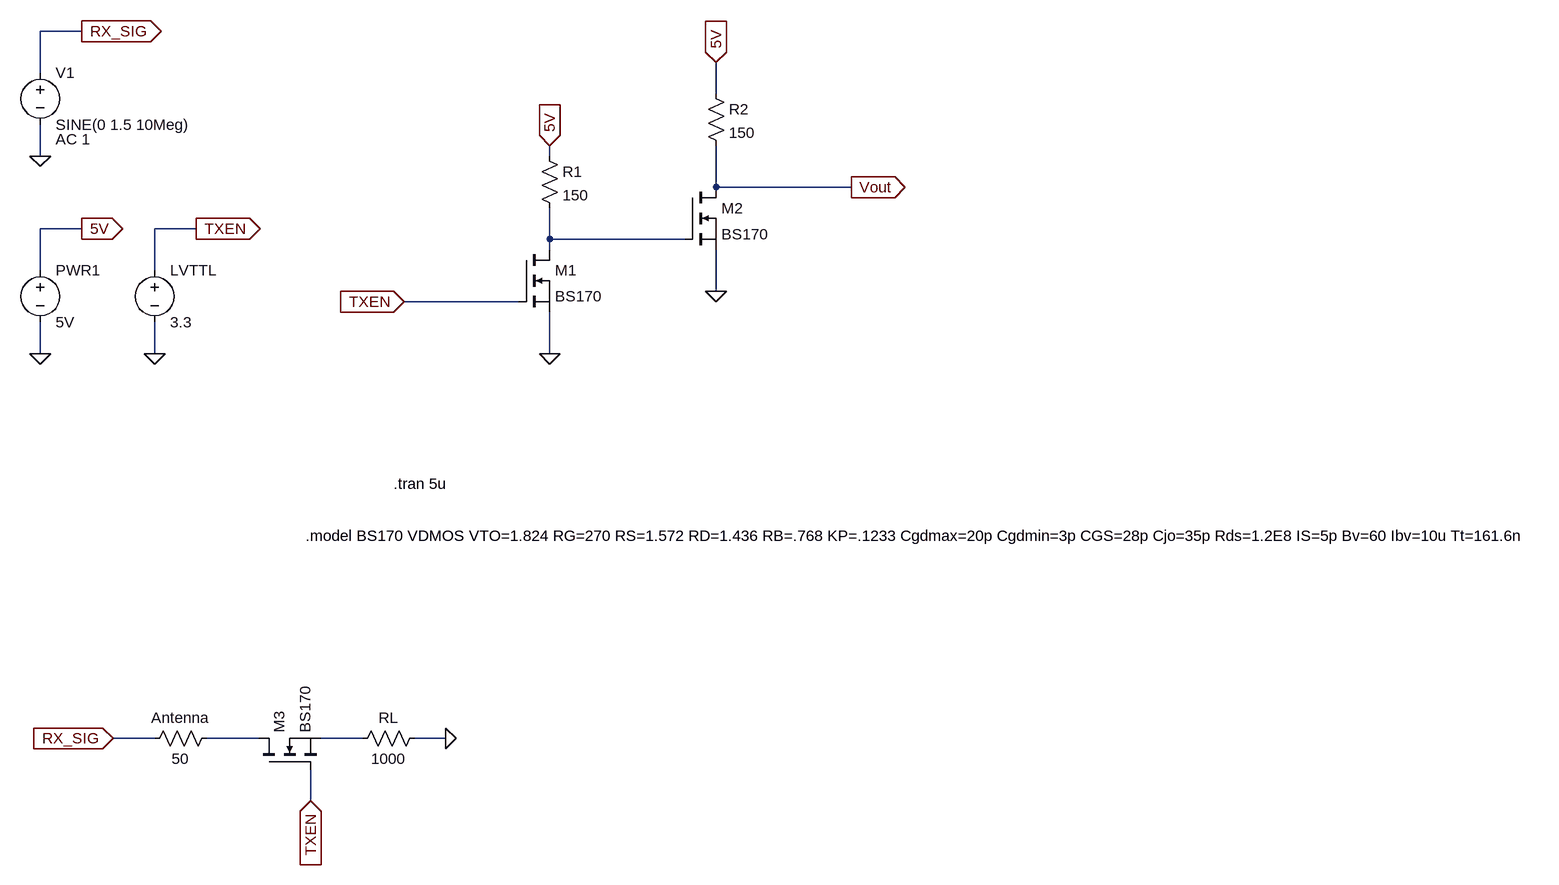
[diagram p0: schematic SwitchTXEN.asc]
SwitchTXEN.asc, the LTspice schematic file:
Version 4
SHEET 1 1924 1316
WIRE -304 -64 -368 -64
WIRE -368 0 -368 -64
WIRE 672 32 672 -16
WIRE -368 128 -368 80
WIRE 416 128 416 112
WIRE 672 176 672 112
WIRE 880 176 672 176
WIRE -304 240 -368 240
WIRE -128 240 -192 240
WIRE 416 256 416 208
WIRE 624 256 416 256
WIRE 416 272 416 256
WIRE -368 304 -368 240
WIRE -192 304 -192 240
WIRE 672 336 672 272
WIRE 368 352 192 352
WIRE -368 432 -368 384
WIRE -192 432 -192 384
WIRE 416 432 416 368
WIRE -192 1024 -256 1024
WIRE -32 1024 -112 1024
WIRE 128 1024 64 1024
WIRE 256 1024 208 1024
WIRE 48 1120 48 1072
FLAG -368 432 0
FLAG -304 240 5V
IOPIN -304 240 Out
FLAG -192 432 0
FLAG -128 240 TXEN
IOPIN -128 240 Out
FLAG 192 352 TXEN
IOPIN 192 352 In
FLAG 416 112 5V
IOPIN 416 112 In
FLAG 880 176 Vout
IOPIN 880 176 Out
FLAG 416 432 0
FLAG 672 336 0
FLAG -368 128 0
FLAG -304 -64 RX_SIG
IOPIN -304 -64 Out
FLAG 672 -16 5V
IOPIN 672 -16 In
FLAG -256 1024 RX_SIG
IOPIN -256 1024 In
FLAG 48 1120 TXEN
IOPIN 48 1120 In
FLAG 256 1024 0
SYMBOL Voltage -368 288 R0
SYMATTR InstName PWR1
SYMATTR Value 5V
SYMBOL Voltage -192 288 R0
SYMATTR InstName LVTTL
SYMATTR Value 3.3
SYMBOL Res 400 112 R0
SYMATTR InstName R1
SYMATTR Value 150
SYMBOL nmos 368 272 R0
SYMATTR InstName M1
SYMATTR Value BS170
SYMBOL nmos 624 176 R0
SYMATTR InstName M2
SYMATTR Value BS170
SYMBOL Res 656 16 R0
SYMATTR InstName R2
SYMATTR Value 150
SYMBOL Voltage -368 -16 R0
WINDOW 123 24 118 Left 2
SYMATTR Value2 AC 1
SYMATTR InstName V1
SYMATTR Value SINE(0 1.5 10Meg)
SYMBOL Res -96 1008 R90
WINDOW 0 0 56 VBottom 2
WINDOW 3 32 56 VTop 2
SYMATTR InstName Antenna
SYMATTR Value 50
SYMBOL nmos -32 1072 R270
SYMATTR InstName M3
SYMATTR Value BS170
SYMBOL Res 224 1008 R90
WINDOW 0 0 56 VBottom 2
WINDOW 3 32 56 VTop 2
SYMATTR InstName RL
SYMATTR Value 1000
TEXT 40 712 Left 2 !.model BS170 VDMOS VTO=1.824 RG=270 RS=1.572 RD=1.436 RB=.768 KP=.1233 Cgdmax=20p Cgdmin=3p CGS=28p Cjo=35p Rds=1.2E8 IS=5p Bv=60 Ibv=10u Tt=161.6n
TEXT 176 632 Left 2 !.tran 5u

The netlist it stands for:
* SwitchTXEN.asc
V§PWR1 5V 0 5V
V§LVTTL TXEN 0 3.3
R1 5V N001 150
M1 N001 TXEN 0 0 BS170
M2 Vout N001 0 0 BS170
R2 5V Vout 150
V1 RX_SIG 0 SINE(0 1.5 10Meg) AC 1
R§Antenna N002 RX_SIG 50
M3 N002 TXEN N003 N003 BS170
RL 0 N003 1000
.model NMOS NMOS
.model PMOS PMOS
.lib standard.mos
.model BS170 VDMOS VTO=1.824 RG=270 RS=1.572 RD=1.436 RB=.768 KP=.1233 Cgdmax=20p Cgdmin=3p CGS=28p Cjo=35p Rds=1.2E8 IS=5p Bv=60 Ibv=10u Tt=161.6n
.tran 5u
.backanno
.end